# Altium schematic sheet MCU_Schematic.SchDoc
size A3; SheetNumber: 2; SheetTotal: 3; SPICEModelCacheJVWRGEKU: <root> / <DocumentId>JVWRGEKU</DocumentId> / <CacheFrame Number="0"> / <Model Name="cap" Kind="MDL"> / <Text>*Default semiconductor capacitor / .MODEL CAP C()</Text> / </Model> / <Model Name="xtal" Kind="CKT"> / <Text>*Generic type:crystal pkg:HC33/51 / .SUBCKT XTAL 1 2 PARAMS: FREQ=1Meg RS=750 C=13pf Q=1000 / LX 1 3 {((Q*RS)/(6.2831852*FREQ))} IC=0.5M / CX 3 4 {(1/(Q*6.2831852*FREQ*RS))} / C0 1 2 {C} / RS 4 2 {RS} / .ENDS XTAL</Text> / </Model> / </CacheFrame> / </root>
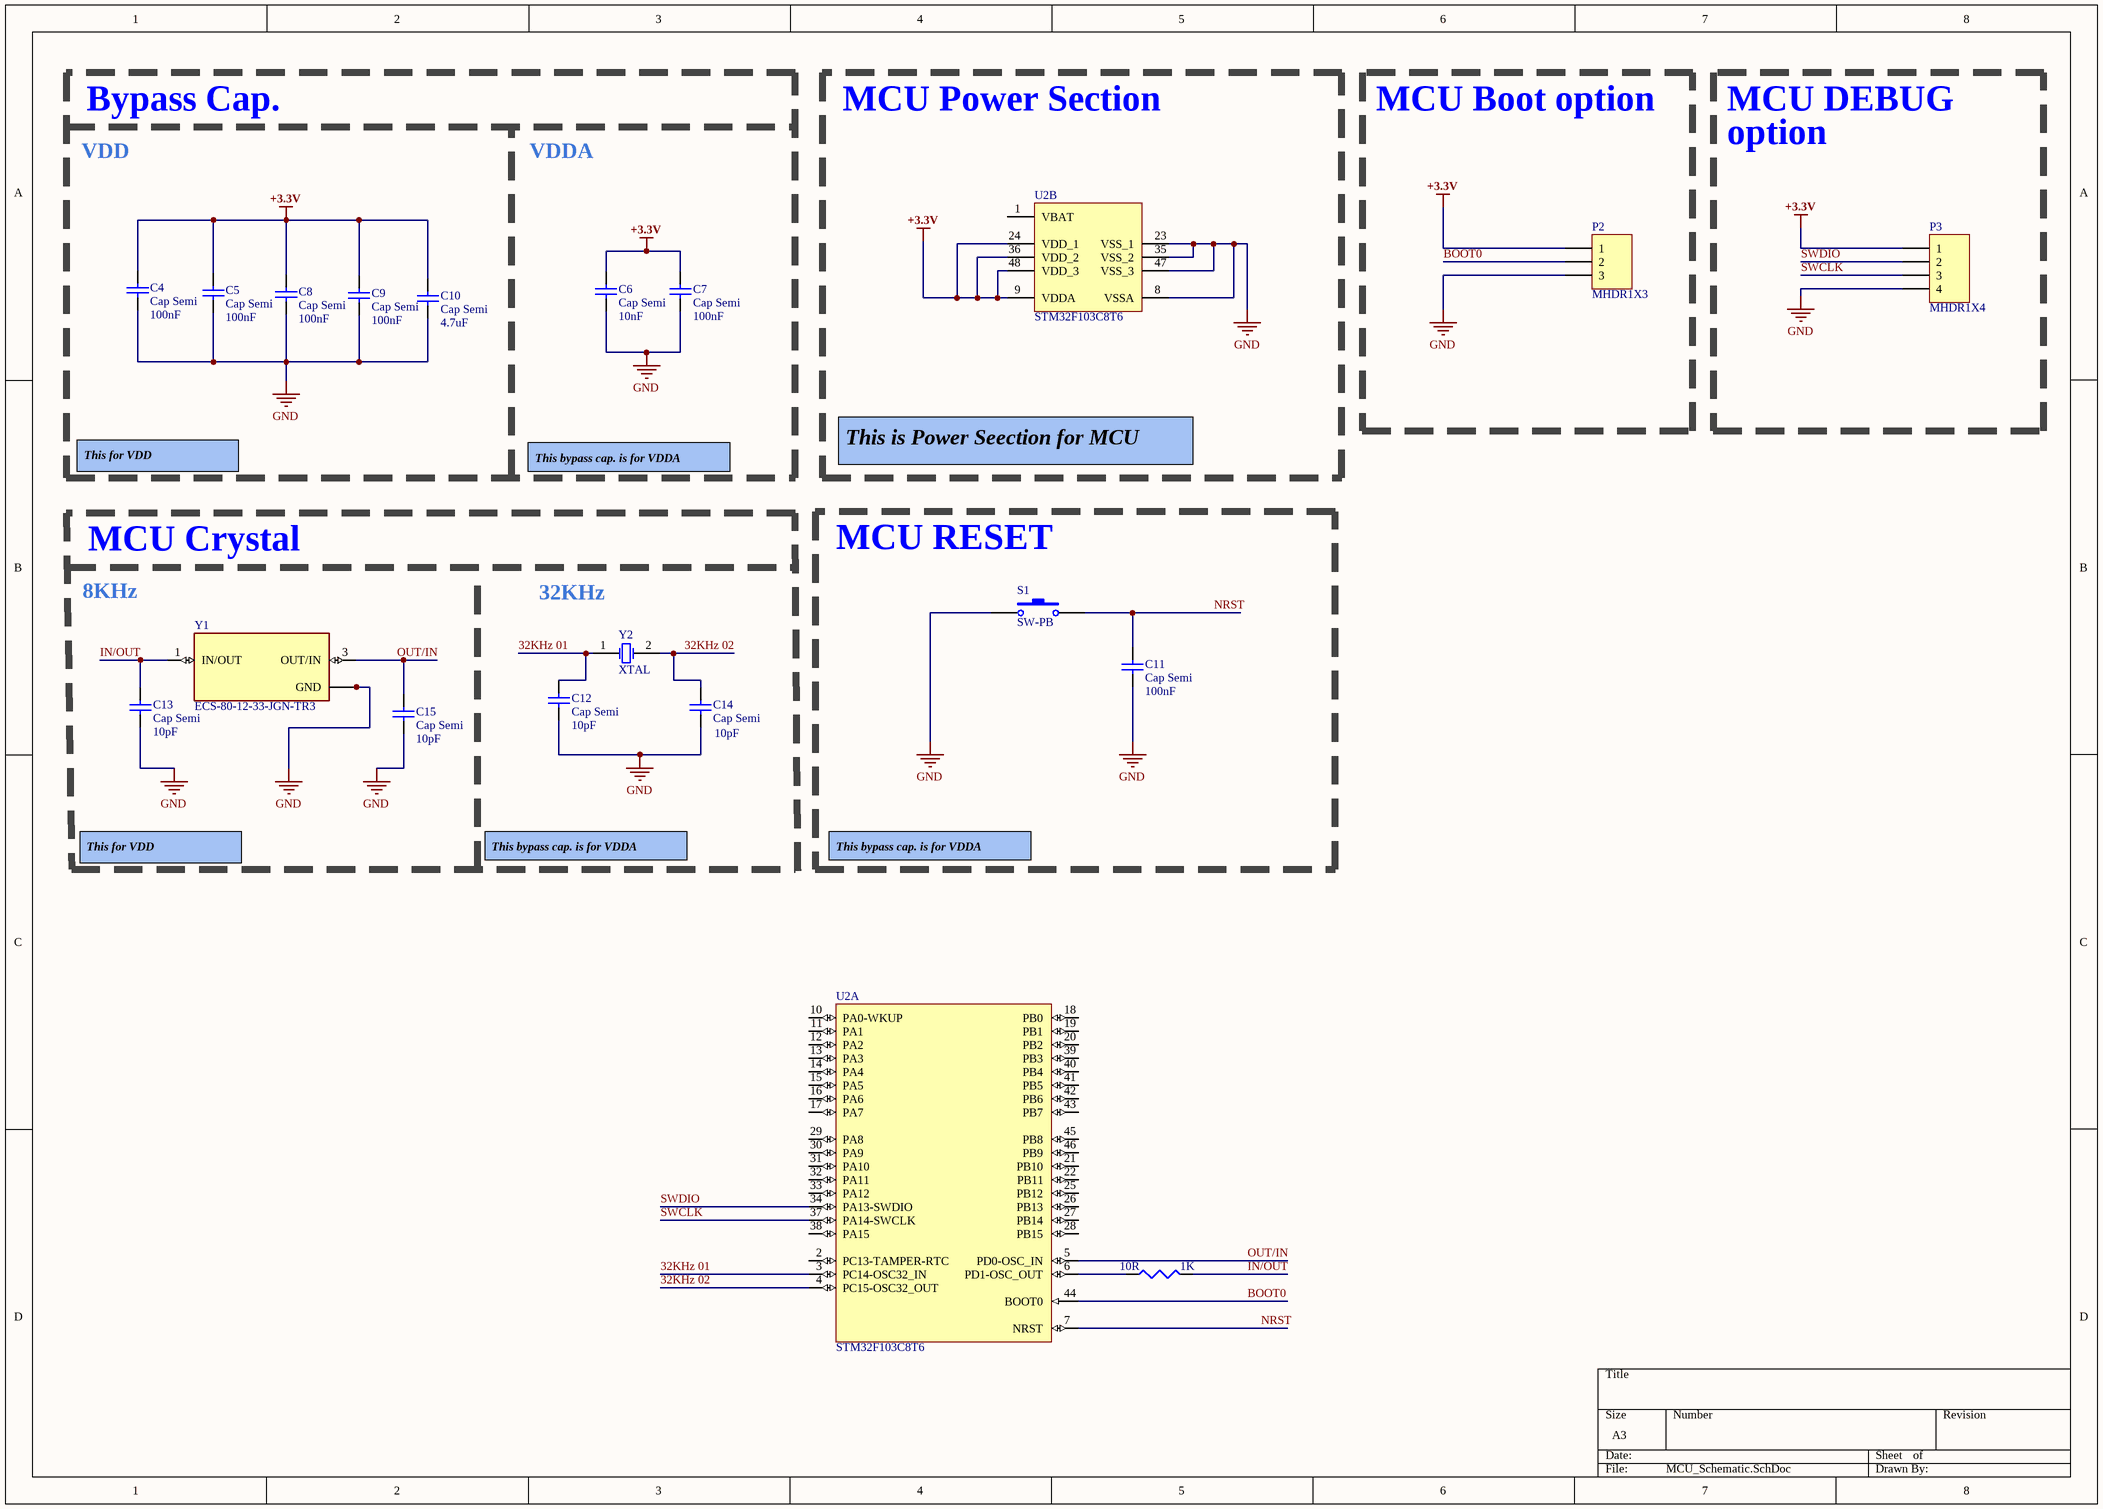
[diagram p0: MCU_Schematic.SchDoc]

## Parts
10R  value 1K  [J1-0603]  (hidden comment: Res3)
C4  Cap Semi  value 100nF  [1608[0603]]
C5  Cap Semi  value 100nF  [1608[0603]]
C6  Cap Semi  value 10nF  [1608[0603]]
C7  Cap Semi  value 100nF  [1608[0603]]
C8  Cap Semi  value 100nF  [1608[0603]]
C9  Cap Semi  value 100nF  [1608[0603]]
C10  Cap Semi  value 4.7uF  [1608[0603]]
C11  Cap Semi  value 100nF  [1608[0603]]
C12  Cap Semi  value 10pF  [0402]
C13  Cap Semi  value 10pF  [0402]
C14  Cap Semi  value 10pF  [0402]
C15  Cap Semi  value 10pF  [0402]
P2  MHDR1X3  [MHDR1X3]
P3  MHDR1X4  [MHDR1X4]
S1  SW-PB  [SPST-2]
U2  STM32F103C8T6  [LQFP48_N]  (parts A,B of 2)
Y1  ECS-80-12-33-JGN-TR3  [XTAL_ECS-240-8-33-AGN-TR]
Y2  XTAL  [R38]

## Blocks framed on the sheet
Bypass Cap.: C4-C10
MCU Power Section: U2
MCU Boot option: P2
MCU Crystal: C12-C15 Y1 Y2

## Nets
+3.3V: C4.1 C5.2 C6.2 C7.2 C8.2 C9.2 C10.2 P2.1 P3.1 U2.9(VDDA) U2.24(VDD_1) U2.36(VDD_2) U2.48(VDD_3)
GND: C4.2 C5.1 C6.1 C7.1 C8.1 C9.1 C10.1 C11.1 C12.1 C13.1 C14.1 C15.1 P2.3 P3.4 S1.1 U2.8(VSSA) U2.23(VSS_1) U2.35(VSS_2) U2.47(VSS_3) Y1.2(GND) Y1.4(GND)
32KHz 01: C12.2 U2.3(PC14-OSC32_IN) Y2.1(OSC1)
32KHz 02: C14.2 U2.4(PC15-OSC32_OUT) Y2.2(OSC2)
BOOT0: P2.2 U2.44(BOOT0)
IN/OUT: 10R.2 C13.2 Y1.1(IN/OUT)
NRST: C11.2 S1.2 U2.7(NRST)
OUT/IN: C15.2 U2.5(PD0-OSC_IN) Y1.3(OUT/IN)
SWCLK: P3.3 U2.37(PA14-SWCLK)
SWDIO: P3.2 U2.34(PA13-SWDIO)
Net10R_1: 10R.1 U2.6(PD1-OSC_OUT)

Not connected (* = marked no-connect by the designer): U2 1(VBAT) 2(PC13-TAMPER-RTC) 10(PA0-WKUP) 11(PA1) 12(PA2) 13(PA3) 14(PA4) 15(PA5) 16(PA6) 17(PA7) 18(PB0) 19(PB1) 20(PB2) 21(PB10) 22(PB11) 25(PB12) 26(PB13) 27(PB14) 28(PB15) 29(PA8) 30(PA9) 31(PA10) 32(PA11) 33(PA12) 38(PA15) 39(PB3) 40(PB4) 41(PB5) 42(PB6) 43(PB7) 45(PB8) 46(PB9)

## Notes on the sheet
- VDD
- VDDA
- MCU DEBUG
- option
- This for VDD
- This bypass cap. is for VDDA
- This is Power Seection for MCU
- MCU RESET
- 8KHz
- 32KHz

## Library data of the parts
10R = Res3: Resistor; Published: 8-Jun-2000; LatestRevisionDate: 29-May-2009; LatestRevisionNote: IPC-7351 Footprint Added.; PackageReference: J1-0603; Publisher: Altium Limited; PackageDescription: Chip Resistor
C4-C15 = Cap Semi: Capacitor (Semiconductor SIM Model); Published: 8-Jun-2000; LatestRevisionDate: 29-May-2009; LatestRevisionNote: IPC-7351 Footprint Added.; PackageReference: C1206; Publisher: Altium Limited; PackageDescription: Chip Capacitor
P2 = MHDR1X3: Header, 3-Pin; LatestRevisionDate: 17-Jul-2002; LatestRevisionNote: Re-released for DXP Platform.; Publisher: Altium Limited
P3 = MHDR1X4: Header, 4-Pin; LatestRevisionDate: 17-Jul-2002; LatestRevisionNote: Re-released for DXP Platform.; Publisher: Altium Limited
S1 = SW-PB: Switch; Published: 24-Mar-1999; LatestRevisionDate: 17-Jul-2002; LatestRevisionNote: Re-released for DXP Platform.; PackageReference: SPST-2; Publisher: Altium Limited; PackageDescription: Switch; 2 Leads
U2 = STM32F103C8T6: STM32 ARM-based 32-bit MCU Performance Line with 64 kB Flash, 20 kB Internal RAM, -40 to +85°C Temperature, 48-Pin LQFP, Tray; DatasheetVersion: rev13.0, Apr-2011; PackageVersion: rev13, Apr-2011; PackageReference: LQFP48; PackageDescription: 48-Pin Low-Profile Quad Flat Pack, 7 x 7 mm Body, 0.5 mm Pitch (LQFP48); ComponentLink1Description: Manufacturer URL; ComponentLink1URL: http://www.st.com/; ComponentLink2Description: STM32F103 Datasheet; ComponentLink2URL: http://www.st.com/internet/com/TECHNICAL_RESOURCES/TECHNICAL_LITERATURE/DATASHEET/CD00161566.pdf; ComponentLink3Description: STM32 Family Web Page; ComponentLink3URL: www.st.com/stm32
Y1 = ECS-80-12-33-JGN-TR3: Crystal 8MHz Â±20ppm (Tol) Â±30ppm (Stability) 12pF FUND 400Ohm 4-Pin Mini-CSMD T/R; MF: ECS Inc.; Check_prices: https://www.snapeda.com/parts/ECS-80-12-33-JGN-TR3/ECS+Inc./view-part/?ref=eda; Availability: In Stock; Package: None; MP: ECS-80-12-33-JGN-TR3; Value: *; Purchase-URL: https://pricing.snapeda.com/search/part/ECS-80-12-33-JGN-TR3/?ref=eda; SnapEDA_Link: https://www.snapeda.com/parts/ECS-80-12-33-JGN-TR3/ECS+Inc./view-part/?ref=snap; Price: None
Y2 = XTAL: Crystal Oscillator; Published: 8-Jun-2000; LatestRevisionDate: 17-Jul-2002; LatestRevisionNote: Re-released for DXP Platform.; PackageReference: R38; Publisher: Altium Limited; PackageDescription: Crystal, Thru-Hole; 2 Leads; Body 3.1 x 8.2 mm (Dia.xH)